# EAGLE design ComsPCB_1P (EAGLE 9.6.2)
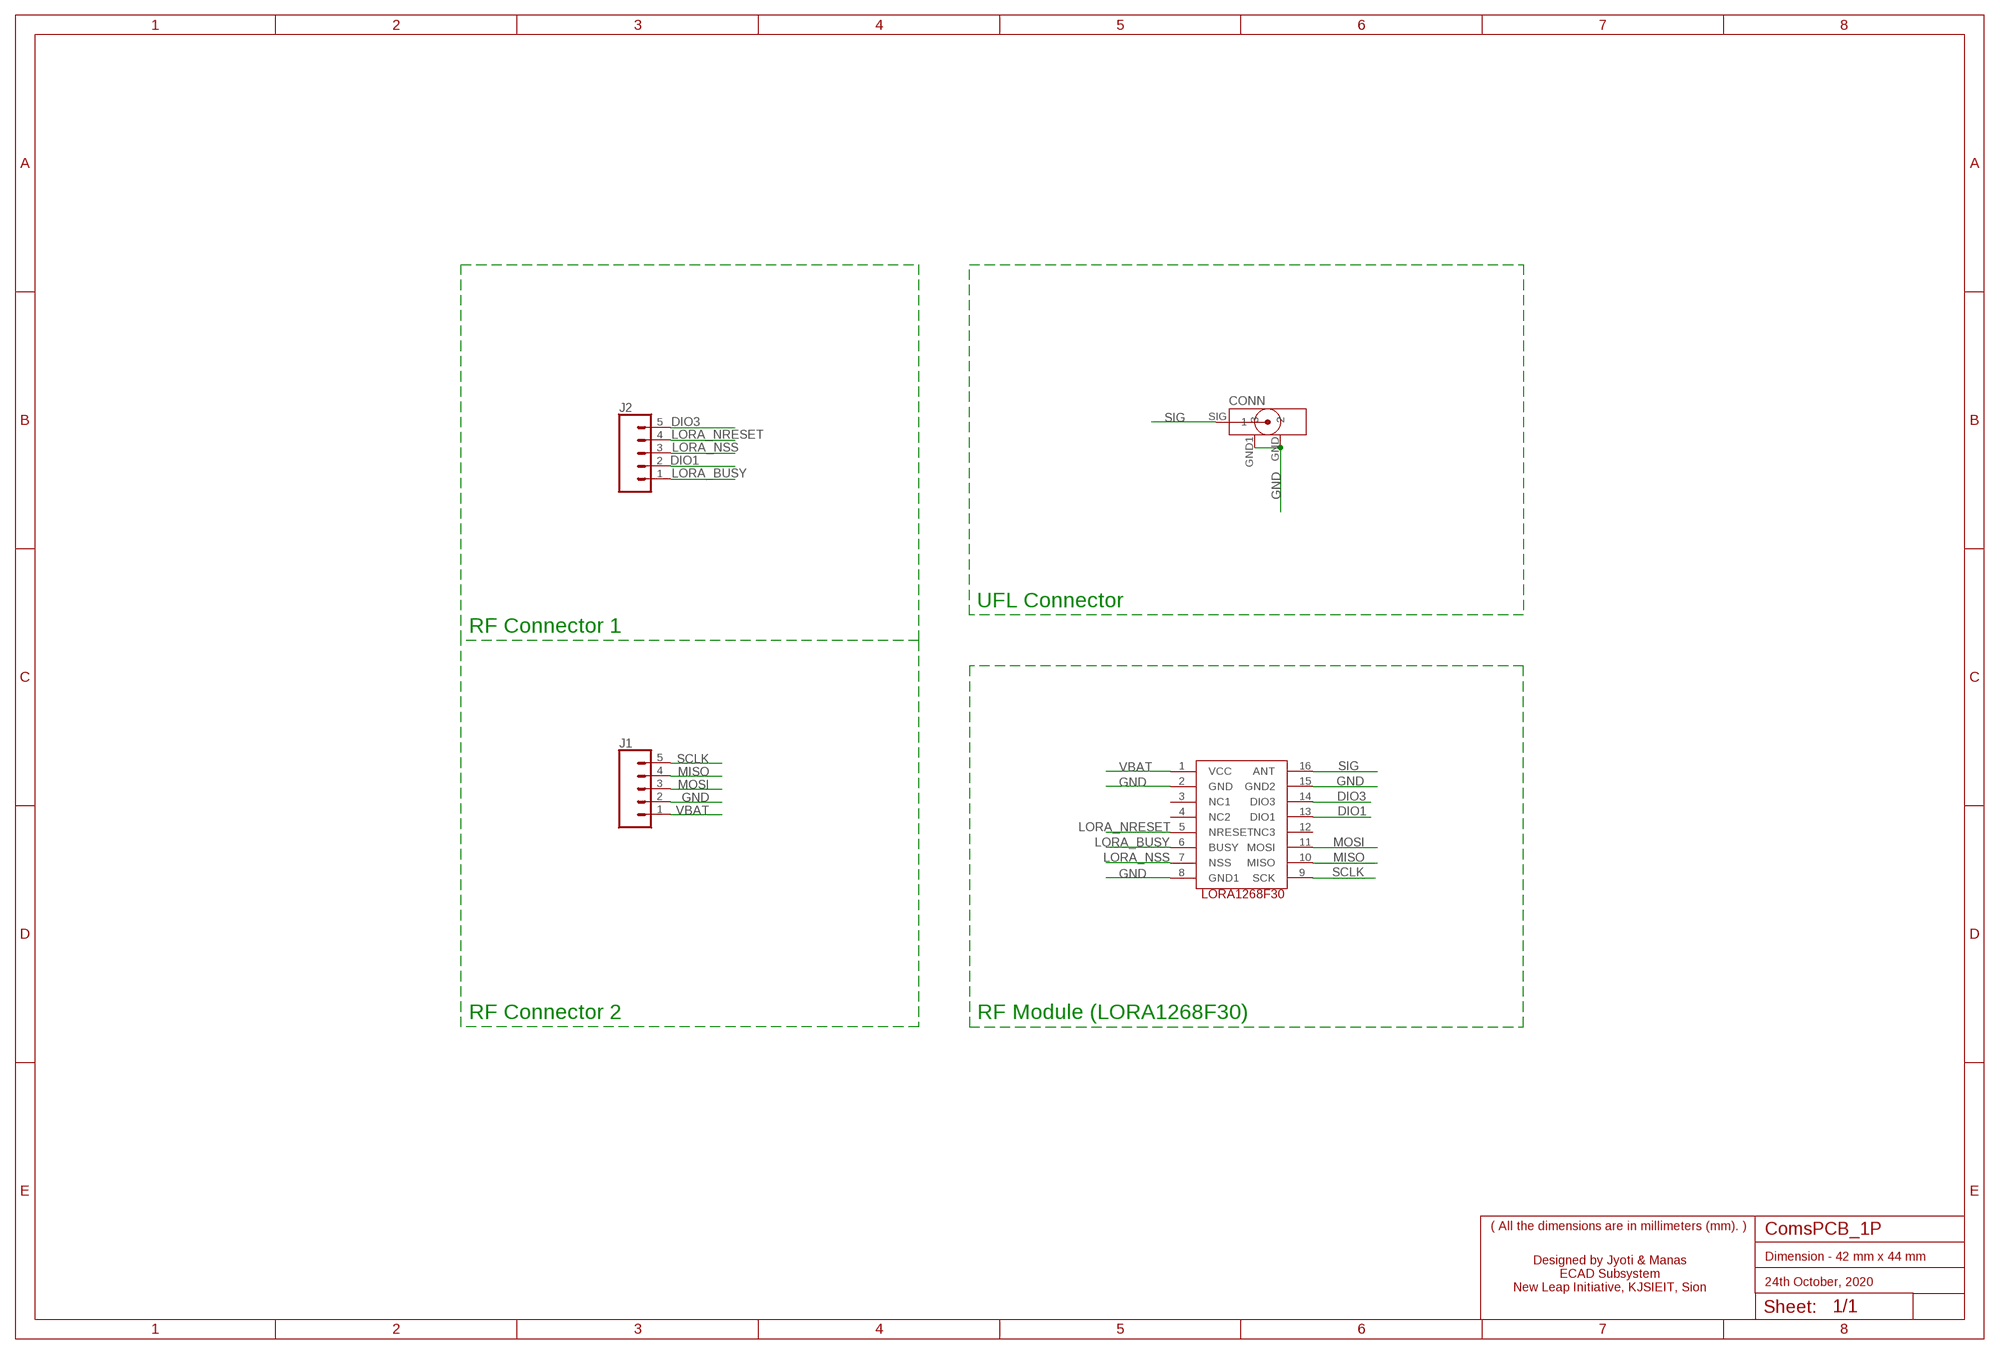
[diagram p0: schematic, sheet 1]

## Parts
CONN  U.FL-R-SMT(10)  [U.FL-R-SMT(10)]
J1  CONN_051.27MM  [1X05_1.27MM]
J2  CONN_051.27MM  [1X05_1.27MM]
U$1  U1  LORA1268F30  [LORA1268F30]

## Nets
DIO1: J2.2 U$1.13(DIO1)
DIO3: J2.5 U$1.14(DIO3)
GND: CONN.GND CONN.GND1 J1.2 U$1.2(GND) U$1.8(GND1) U$1.15(GND2)
LORA_BUSY: J2.1 U$1.6(BUSY)
LORA_NRESET: J2.4 U$1.5(NRESET)
LORA_NSS: J2.3 U$1.7(NSS)
MISO: J1.4 U$1.10(MISO)
MOSI: J1.3 U$1.11(MOSI)
SCLK: J1.5 U$1.9(SCK)
SIG: CONN.SIG U$1.16(ANT)
VBAT: J1.1 U$1.1(VCC)
Unconnected: U$1.3(NC1) U$1.4(NC2) U$1.12(NC3)

## Notes on the sheet
- UFL Connector
- RF Connector 1
- RF Connector 2 | RF Module (LORA1268F30)
- ( All the dimensions are in millimeters (mm). )
- Dimension - 42 mm x 44 mm
- Designed by Jyoti & Manas
  ECAD Subsystem
  New Leap Initiative, KJSIEIT, Sion
- 24th October, 2020

## Library data of the parts
CONN = Connectors:U.FL-R-SMT(10): CONN U.FL RCPT STR 50 OHM SMD Manufacturer's datasheet <https://media.digikey.com/pdf/Data%20Sheets/Hirose%20PDFs/UFL%20Series.pdf>; CREATED_BY: PCBLayout.com; DIGIKEY_PART_NUMBER: H9161CT-ND; MANUFACTURER: Hirose Electric Co Ltd; MPN: U.FL-R-SMT(10); PACKAGE: SMD
J1 J2 = SparkFun-Connectors:CONN_05: Multi connection point. Often used as Generic Header-pin footprint for 0.1 inch spaced/style header connections On any of the 0.1 inch spaced packages, you can populate with these: Break Away Headers - Straight <https://www.sparkfun.com/products/116> (PRT-00116) Break Away Male Headers - Right Angle <https://www.sparkfun.com/products/553> (PRT-00553) Female Headers <https://www.sparkfun.com/products/115> (PRT-00115) Break Away Headers - Machine Pin <https://www.sparkfun.com/products/117> (PRT-00117) Break Away Female Headers - Swiss Machine Pin <https://www.sparkfun.com/products/743> (PRT-00743) For SCREWTERMINALS and SPRING TERMINALS visit here: Screw Terimnals on SparkFun.com <https://www.sparkfun.com/search/results?term=Screw+Terminals> (5mm/3.5mm/2.54mm spacing) This device is also useful as a general connection point to wire up your design to another part of your project. Our various solder wires solder well into these plated through hole pads. Hook-Up Wire - Assortment (Stranded, 22 AWG) <https://www.sparkfun.com/products/11375> (PRT-11375) Hook-Up Wire - Assortment (Solid Core, 22 AWG) <https://www.sparkfun.com/products/11367> (PRT-11367) View the entire wire category on our website here <https://www.sparkfun.com/categories/141> Special notes: Molex polarized connector foot print use with SKU : PRT-08231 with associated crimp pins and housings. 1MM SMD Version SKU: PRT-10208
U$1 = LORA1268f30:LORA1268F30

## Board
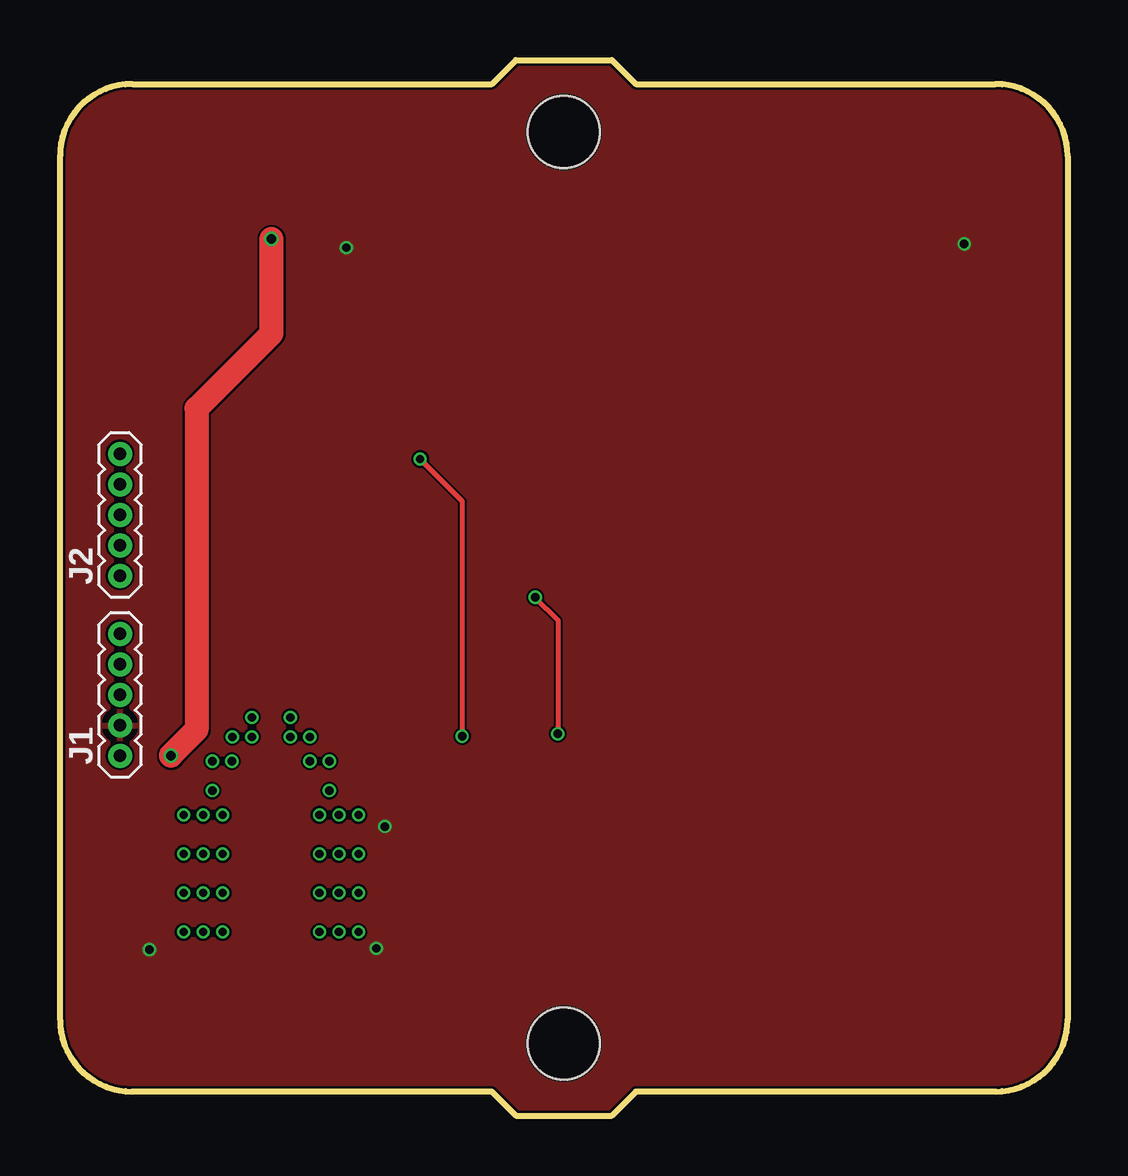
[diagram p1: board, top side]
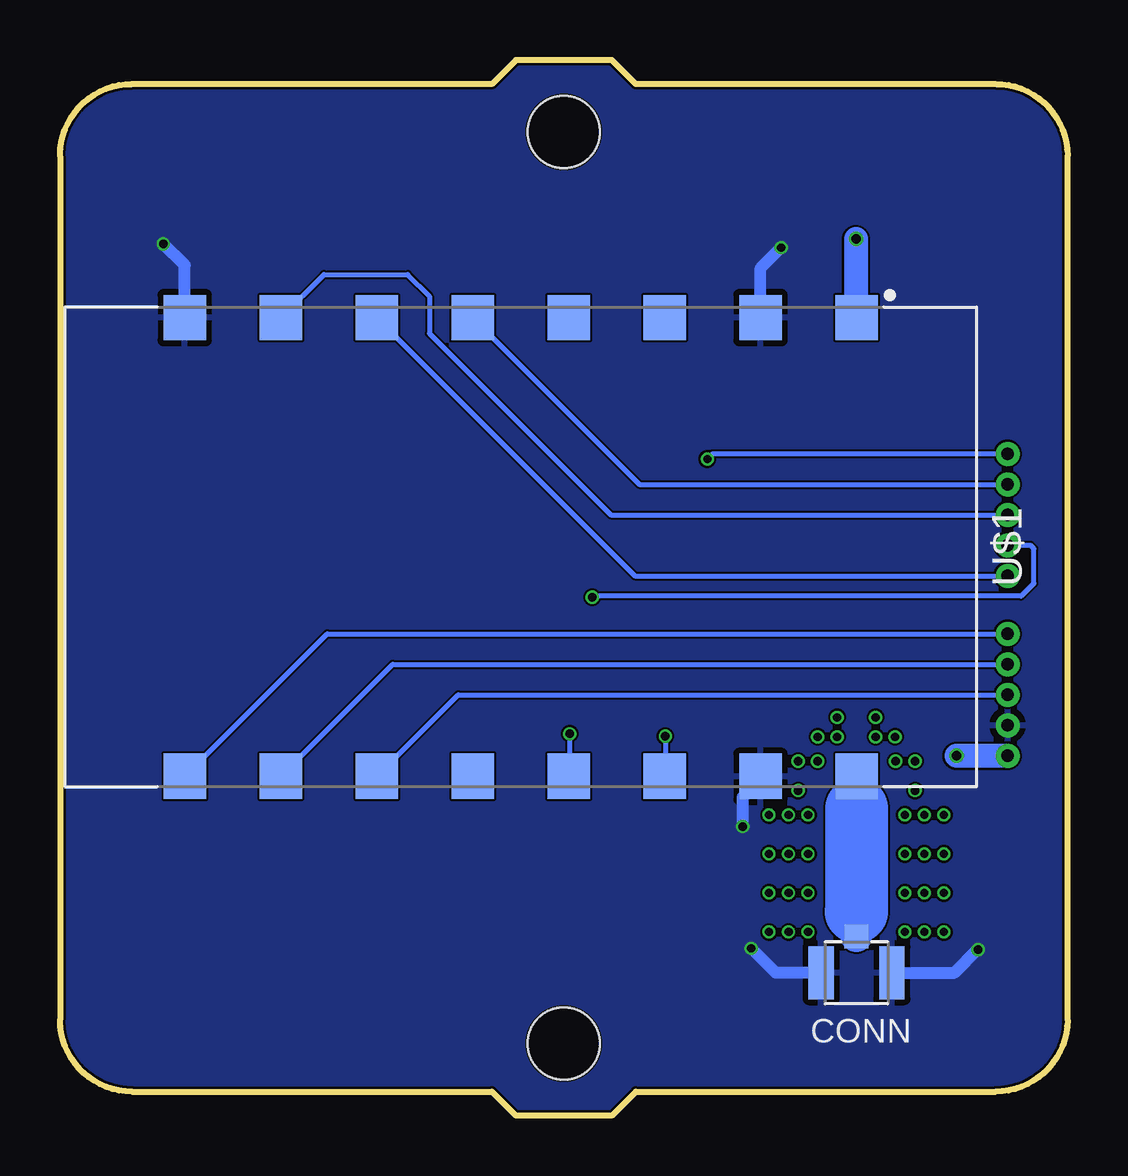
[diagram p2: board, bottom side, seen from below]

Size 42 x 44 mm. Coordinates in mm from the lower left corner, seen from the top.
Outline: 0,4 arc90 3,1 18,1 19,0 23,0 24,1 39,1 arc90 42,4 42,40 arc90 39,43 24,43 23,44 19,44 18,43 3,43 arc90 0,40 0,4
Copper layers (1*16): Top 0.035mm / dielectric 0.2mm / Bottom 0.035mm
Design rules "jlcpcb-2-layer": minimum track width 3.5mil, minimum drill 0.2mm, track to track 3.5mil, track to pad 5mil, pad to pad 5mil, via to via 5mil, smd to smd 0mil, copper to edge 0.1mm, drill to drill 5mil, minimum pad ring 4mil, minimum via ring 4mil, stop-mask expansion 3mil, vias tented up to drill 100mil, thermal gap 10mil
Holes 3 mm at 21,41 21,3

### Footprints (pad centres in the part's own frame; a part is rotated, then mirrored left to right if it is on the bottom)
U.FL-R-SMT(10) = smd 1.05 x 2.2: GND -1.475,0; GND1 1.475,0 | smd 1 x 1: SIG 0,-1.525
1X05_1.27MM = drill 0.508 pad 1: 1 0,0; 2 1.27,0; 3 2.54,0; 4 3.81,0; 5 5.08,0
LORA1268F30 = smd 1.892 x 1.772: 1 -9.56,14; 2 -9.56,10; 3 -9.56,6; 4 -9.56,2; 5 -9.56,-2; 6 -9.56,-6; 7 -9.56,-10; 8 -9.56,-14; 9 9.56,-14; 10 9.56,-10; 11 9.56,-6; 12 9.56,-2; 13 9.56,2; 14 9.56,6; 15 9.56,10; 16 9.56,14

### Placement (x,y rotation side)
CONN  8.8,5.95 180 bottom
J1  2.5,15 90 top
J2  2.5,22.5 90 top
U$1  22.8,23.7 270 bottom

### Tracks (layer width: path | path; a pad name or v marks a point on that pad's centre or on a via)
DIO1  (via drill 0.35)
  Top 0.2: v19.81,21.6 20.75,20.66 v20.75,15.91
  Bottom 0.2: J2.2 1.54,23.77 1.4,23.63 1.4,22.18 1.93,21.65 19.76,21.65 v19.81,21.6 | v20.75,15.91 20.75,14.19 U$1.13
DIO3  (via drill 0.35)
  Top 0.2: v15.01,27.36 16.76,25.61 v16.76,15.81
  Bottom 0.2: J2.5 14.8,27.58 v15.01,27.36 | v16.76,15.81 16.76,14.18 U$1.14
GND  (via drill 0.35)
  Bottom 0.5: U$1.15 12.8,14.01 13.54,13.27 v13.54,12.05 | U$1.2 12.8,35.32 v11.94,36.18 | U$1.8 36.8,35.44 v37.69,36.33 | CONN.GND1 12.16,5.95 v13.18,6.97 | CONN.GND 4.7,5.95 v3.73,6.92
  pour Top: -2.64,42.76 0.1,45.5 40.92,45.5 43.99,42.43 43.99,-0.27 42.01,-2.25 -0.51,-2.25 -2.67,-0.09 -2.67,42.73
  pour Bottom: -2.67,42.78 0.05,45.5 40.94,45.5 44.02,42.43 44.02,42.3 44.02,-0.24 42.14,-2.12 -0.53,-2.12 -2.64,-0.02 -2.64,42.76
LORA_BUSY
  Bottom 0.2: U$1.6 18.04,22.5 J2.1
LORA_NRESET
  Bottom 0.2: U$1.5 17.85,26.31 J2.4
LORA_NSS
  Bottom 0.2: U$1.7 31,35.06 27.51,35.06 26.59,34.15 26.59,32.6 19.04,25.04 J2.3
MISO
  Bottom 0.2: U$1.10 28.13,18.81 J1.4
MOSI
  Bottom 0.2: U$1.11 25.4,17.54 J1.3
N$1  (via drill 0.35)
  other vias: 5.97,10.91
N$2  (via drill 0.35)
  other vias: 5.97,9.28
N$3  (via drill 0.35)
  other vias: 5.97,7.65
N$4  (via drill 0.35)
  other vias: 5.97,12.53
N$5  (via drill 0.35)
  other vias: 5.16,10.91
N$6  (via drill 0.35)
  other vias: 5.16,9.28
N$7  (via drill 0.35)
  other vias: 5.16,7.65
N$8  (via drill 0.35)
  other vias: 5.16,12.53
N$9  (via drill 0.35)
  other vias: 11.63,10.91
N$10  (via drill 0.35)
  other vias: 11.63,9.28
N$11  (via drill 0.35)
  other vias: 7.16,14.77
N$12  (via drill 0.35)
  other vias: 10.41,14.77
N$13  (via drill 0.35)
  other vias: 6.35,13.55
N$14  (via drill 0.35)
  other vias: 6.35,14.77
N$15  (via drill 0.35)
  other vias: 8,15.78
N$16  (via drill 0.35)
  other vias: 9.6,15.78
N$17  (via drill 0.35)
  other vias: 7.19,15.78
N$18  (via drill 0.35)
  other vias: 8,16.6
N$19  (via drill 0.35)
  other vias: 9.6,16.6
N$20  (via drill 0.35)
  other vias: 10.41,15.78
N$21  (via drill 0.35)
  other vias: 11.23,14.77
N$22  (via drill 0.35)
  other vias: 11.23,13.55
N$23  (via drill 0.35)
  other vias: 10.82,12.53
N$24  (via drill 0.35)
  other vias: 10.82,10.91
N$25  (via drill 0.35)
  other vias: 6.78,10.91
N$26  (via drill 0.35)
  other vias: 6.78,9.28
N$27  (via drill 0.35)
  other vias: 10.82,9.28
N$28  (via drill 0.35)
  other vias: 6.78,7.65
N$29  (via drill 0.35)
  other vias: 10.82,7.65
N$30  (via drill 0.35)
  other vias: 6.78,12.53
N$31  (via drill 0.35)
  other vias: 11.63,7.65
N$32  (via drill 0.35)
  other vias: 11.63,12.53
N$33  (via drill 0.35)
  other vias: 12.45,10.91
N$34  (via drill 0.35)
  other vias: 12.45,9.28
N$35  (via drill 0.35)
  other vias: 12.45,7.65
N$36  (via drill 0.35)
  other vias: 12.45,12.53
SCLK
  Bottom 0.2: U$1.9 30.86,20.08 J1.5
SIG
  Bottom 1.308: U$1.16 8.8,12.8 | 8.81,8.49 8.81,7.49 CONN.SIG
  Bottom 2.616: 8.8,12.8 8.8,8.51 8.81,8.49
VBAT  (via drill 0.4)
  Top 1: v4.63,15 4.63,15.03 5.69,16.09 5.69,29.47 8.81,32.6 v8.81,36.53
  Bottom 1: J1.1 v4.63,15 | v8.81,36.53 8.81,33.27 U$1.1